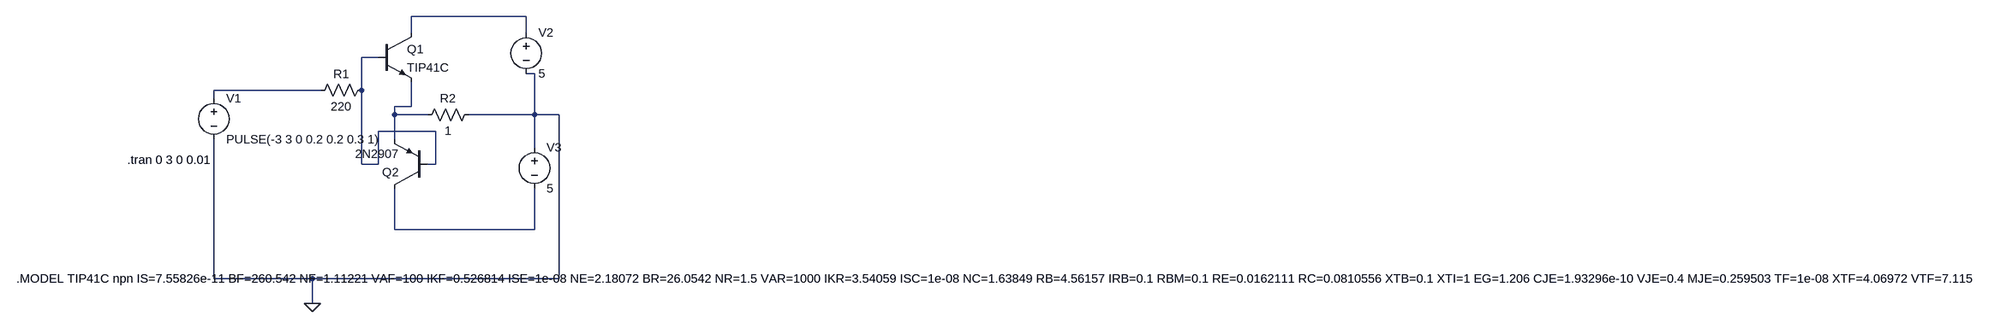
[diagram p0: schematic push-pull.asc]
push-pull.asc, the LTspice schematic file:
Version 4
SHEET 1 4988 680
WIRE 560 64 336 64
WIRE 336 96 336 64
WIRE 560 96 560 64
WIRE 272 144 240 144
WIRE 576 176 560 176
WIRE 160 208 -48 208
WIRE 240 208 240 144
WIRE -48 224 -48 208
WIRE 336 240 336 192
WIRE 336 240 304 240
WIRE 304 256 304 240
WIRE 368 256 304 256
WIRE 576 256 576 176
WIRE 576 256 448 256
WIRE 624 256 576 256
WIRE 384 288 272 288
WIRE 304 304 304 256
WIRE 576 320 576 256
WIRE 240 352 240 208
WIRE 272 352 272 288
WIRE 272 352 240 352
WIRE 384 352 384 288
WIRE 384 352 368 352
WIRE 304 480 304 400
WIRE 576 480 576 400
WIRE 576 480 304 480
WIRE -48 576 -48 304
WIRE 144 576 -48 576
WIRE 624 576 624 256
WIRE 624 576 144 576
WIRE 144 624 144 576
FLAG 144 624 0
SYMBOL voltage -48 208 R0
SYMATTR InstName V1
SYMATTR Value PULSE(-3 3 0 0.2 0.2 0.3 1)
SYMBOL voltage 560 80 R0
SYMATTR InstName V2
SYMATTR Value 5
SYMBOL voltage 576 304 R0
SYMATTR InstName V3
SYMATTR Value 5
SYMBOL res 256 192 R90
WINDOW 0 0 56 VBottom 2
WINDOW 3 32 56 VTop 2
SYMATTR InstName R1
SYMATTR Value 220
SYMBOL res 464 240 R90
WINDOW 0 0 56 VBottom 2
WINDOW 3 32 56 VTop 2
SYMATTR InstName R2
SYMATTR Value 1
SYMBOL npn 272 96 R0
SYMATTR InstName Q1
SYMATTR Value TIP41C
SYMBOL pnp 368 400 R180
SYMATTR InstName Q2
SYMATTR Value 2N2907
TEXT -216 344 Left 2 !.tran 0 3 0 0.01
TEXT -432 576 Left 2 !.MODEL TIP41C npn IS=7.55826e-11 BF=260.542 NF=1.11221 VAF=100 IKF=0.526814 ISE=1e-08 NE=2.18072 BR=26.0542 NR=1.5 VAR=1000 IKR=3.54059 ISC=1e-08 NC=1.63849 RB=4.56157 IRB=0.1 RBM=0.1 RE=0.0162111 RC=0.0810556 XTB=0.1 XTI=1 EG=1.206 CJE=1.93296e-10 VJE=0.4 MJE=0.259503 TF=1e-08 XTF=4.06972 VTF=7.1157 ITF=0.001 CJC=1.09657e-10 VJC=0.730921 MJC=0.23 XCJC=0.803085 FC=0.8 CJS=0 VJS=0.75 MJS=0.5 TR=9.01013e-08 PTF=0 KF=0 AF=1

The netlist it stands for:
* push-pull.asc
V1 N003 0 PULSE(-3 3 0 0.2 0.2 0.3 1)
V2 N001 0 5
V3 0 N005 5
R1 N002 N003 220
R2 0 N004 1
Q1 N001 N002 N004 0 TIP41C
Q2 N005 N002 N004 0 2N2907
.model NPN NPN
.model PNP PNP
.lib standard.bjt
.tran 0 3 0 0.01
.MODEL TIP41C npn IS=7.55826e-11 BF=260.542 NF=1.11221 VAF=100 IKF=0.526814 ISE=1e-08 NE=2.18072 BR=26.0542 NR=1.5 VAR=1000 IKR=3.54059 ISC=1e-08 NC=1.63849 RB=4.56157 IRB=0.1 RBM=0.1 RE=0.0162111 RC=0.0810556 XTB=0.1 XTI=1 EG=1.206 CJE=1.93296e-10 VJE=0.4 MJE=0.259503 TF=1e-08 XTF=4.06972 VTF=7.1157 ITF=0.001 CJC=1.09657e-10 VJC=0.730921 MJC=0.23 XCJC=0.803085 FC=0.8 CJS=0 VJS=0.75 MJS=0.5 TR=9.01013e-08 PTF=0 KF=0 AF=1
.backanno
.end